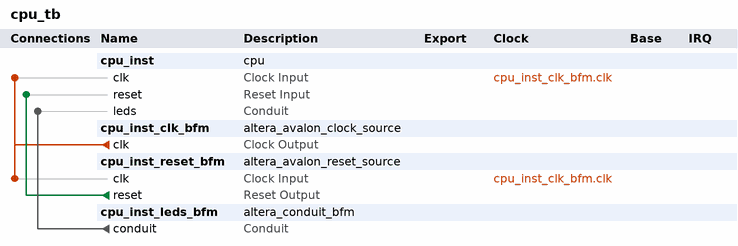
[diagram p0: system contents]
# Platform Designer (Qsys) system cpu_tb, Cyclone V 5CSEMA5F31C6
# Parameters at their usual value, and those the tool derives, are not listed.
package require -exact qsys 18.1
create_system cpu_tb
set_project_property DEVICE_FAMILY {Cyclone V}
set_project_property DEVICE 5CSEMA5F31C6

add_instance cpu_inst cpu 1.0

add_instance cpu_inst_clk_bfm altera_avalon_clock_source 18.1

add_instance cpu_inst_reset_bfm altera_avalon_reset_source 18.1
set_instance_parameter_value cpu_inst_reset_bfm ASSERT_HIGH_RESET 0
set_instance_parameter_value cpu_inst_reset_bfm INITIAL_RESET_CYCLES 50

add_instance cpu_inst_leds_bfm altera_conduit_bfm 18.1
set_instance_parameter_value cpu_inst_leds_bfm CLOCKED_SIGNAL false
set_instance_parameter_value cpu_inst_leds_bfm ENABLE_RESET false
set_instance_parameter_value cpu_inst_leds_bfm SIGNAL_DIRECTIONS input
set_instance_parameter_value cpu_inst_leds_bfm SIGNAL_WIDTHS 2

# connections
add_connection cpu_inst_clk_bfm.clk cpu_inst.clk clock
add_connection cpu_inst_clk_bfm.clk cpu_inst_reset_bfm.clk clock
add_connection cpu_inst_reset_bfm.reset cpu_inst.reset reset
add_connection cpu_inst_leds_bfm.conduit cpu_inst.leds conduit

set_interconnect_requirement {$system} qsys_mm.clockCrossingAdapter HANDSHAKE
set_interconnect_requirement {$system} qsys_mm.enableEccProtection FALSE
set_interconnect_requirement {$system} qsys_mm.insertDefaultSlave FALSE
set_interconnect_requirement {$system} qsys_mm.maxAdditionalLatency 1

save_system cpu_tb.qsys
